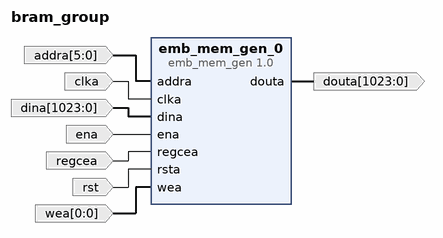
[diagram p0: block diagram of the top level]
# Vivado block design bram_group, xcvh1582-vsva3697-2MP-e-S, Vivado 2024.2
create_bd_design bram_group

create_bd_port -dir I -from 5 -to 0 addra
create_bd_port -dir I -from 0 -to 0 wea
create_bd_port -dir I -type rst rst
create_bd_port -dir I ena
create_bd_port -dir O -from 1023 -to 0 douta
create_bd_port -dir I -from 1023 -to 0 dina
create_bd_port -dir I -type clk clka
create_bd_port -dir I regcea

create_bd_cell -type ip -vlnv xilinx.com:ip:emb_mem_gen:1.0 emb_mem_gen_0
set_property -dict [list \
  CONFIG.MEMORY_DEPTH 40 \
  CONFIG.USE_MEMORY_BLOCK Stand_Alone \
  CONFIG.WRITE_DATA_WIDTH_A 1024 \
] [get_bd_cells emb_mem_gen_0]

# ---- connections ----

connect_bd_net -net addra_0_1 [get_bd_ports addra] [get_bd_pins emb_mem_gen_0/addra]
connect_bd_net -net clka_0_1 [get_bd_ports clka] [get_bd_pins emb_mem_gen_0/clka]
connect_bd_net -net dina_0_1 [get_bd_ports dina] [get_bd_pins emb_mem_gen_0/dina]
connect_bd_net [get_bd_pins emb_mem_gen_0/douta] [get_bd_ports douta]
connect_bd_net -net ena_0_1 [get_bd_ports ena] [get_bd_pins emb_mem_gen_0/ena]
connect_bd_net -net regcea_0_1 [get_bd_ports regcea] [get_bd_pins emb_mem_gen_0/regcea]
connect_bd_net -net rsta_0_1 [get_bd_ports rst] [get_bd_pins emb_mem_gen_0/rsta]
connect_bd_net -net wea_0_1 [get_bd_ports wea] [get_bd_pins emb_mem_gen_0/wea]

validate_bd_design
save_bd_design
